# Altium project PCB_Project1.PrjPCB
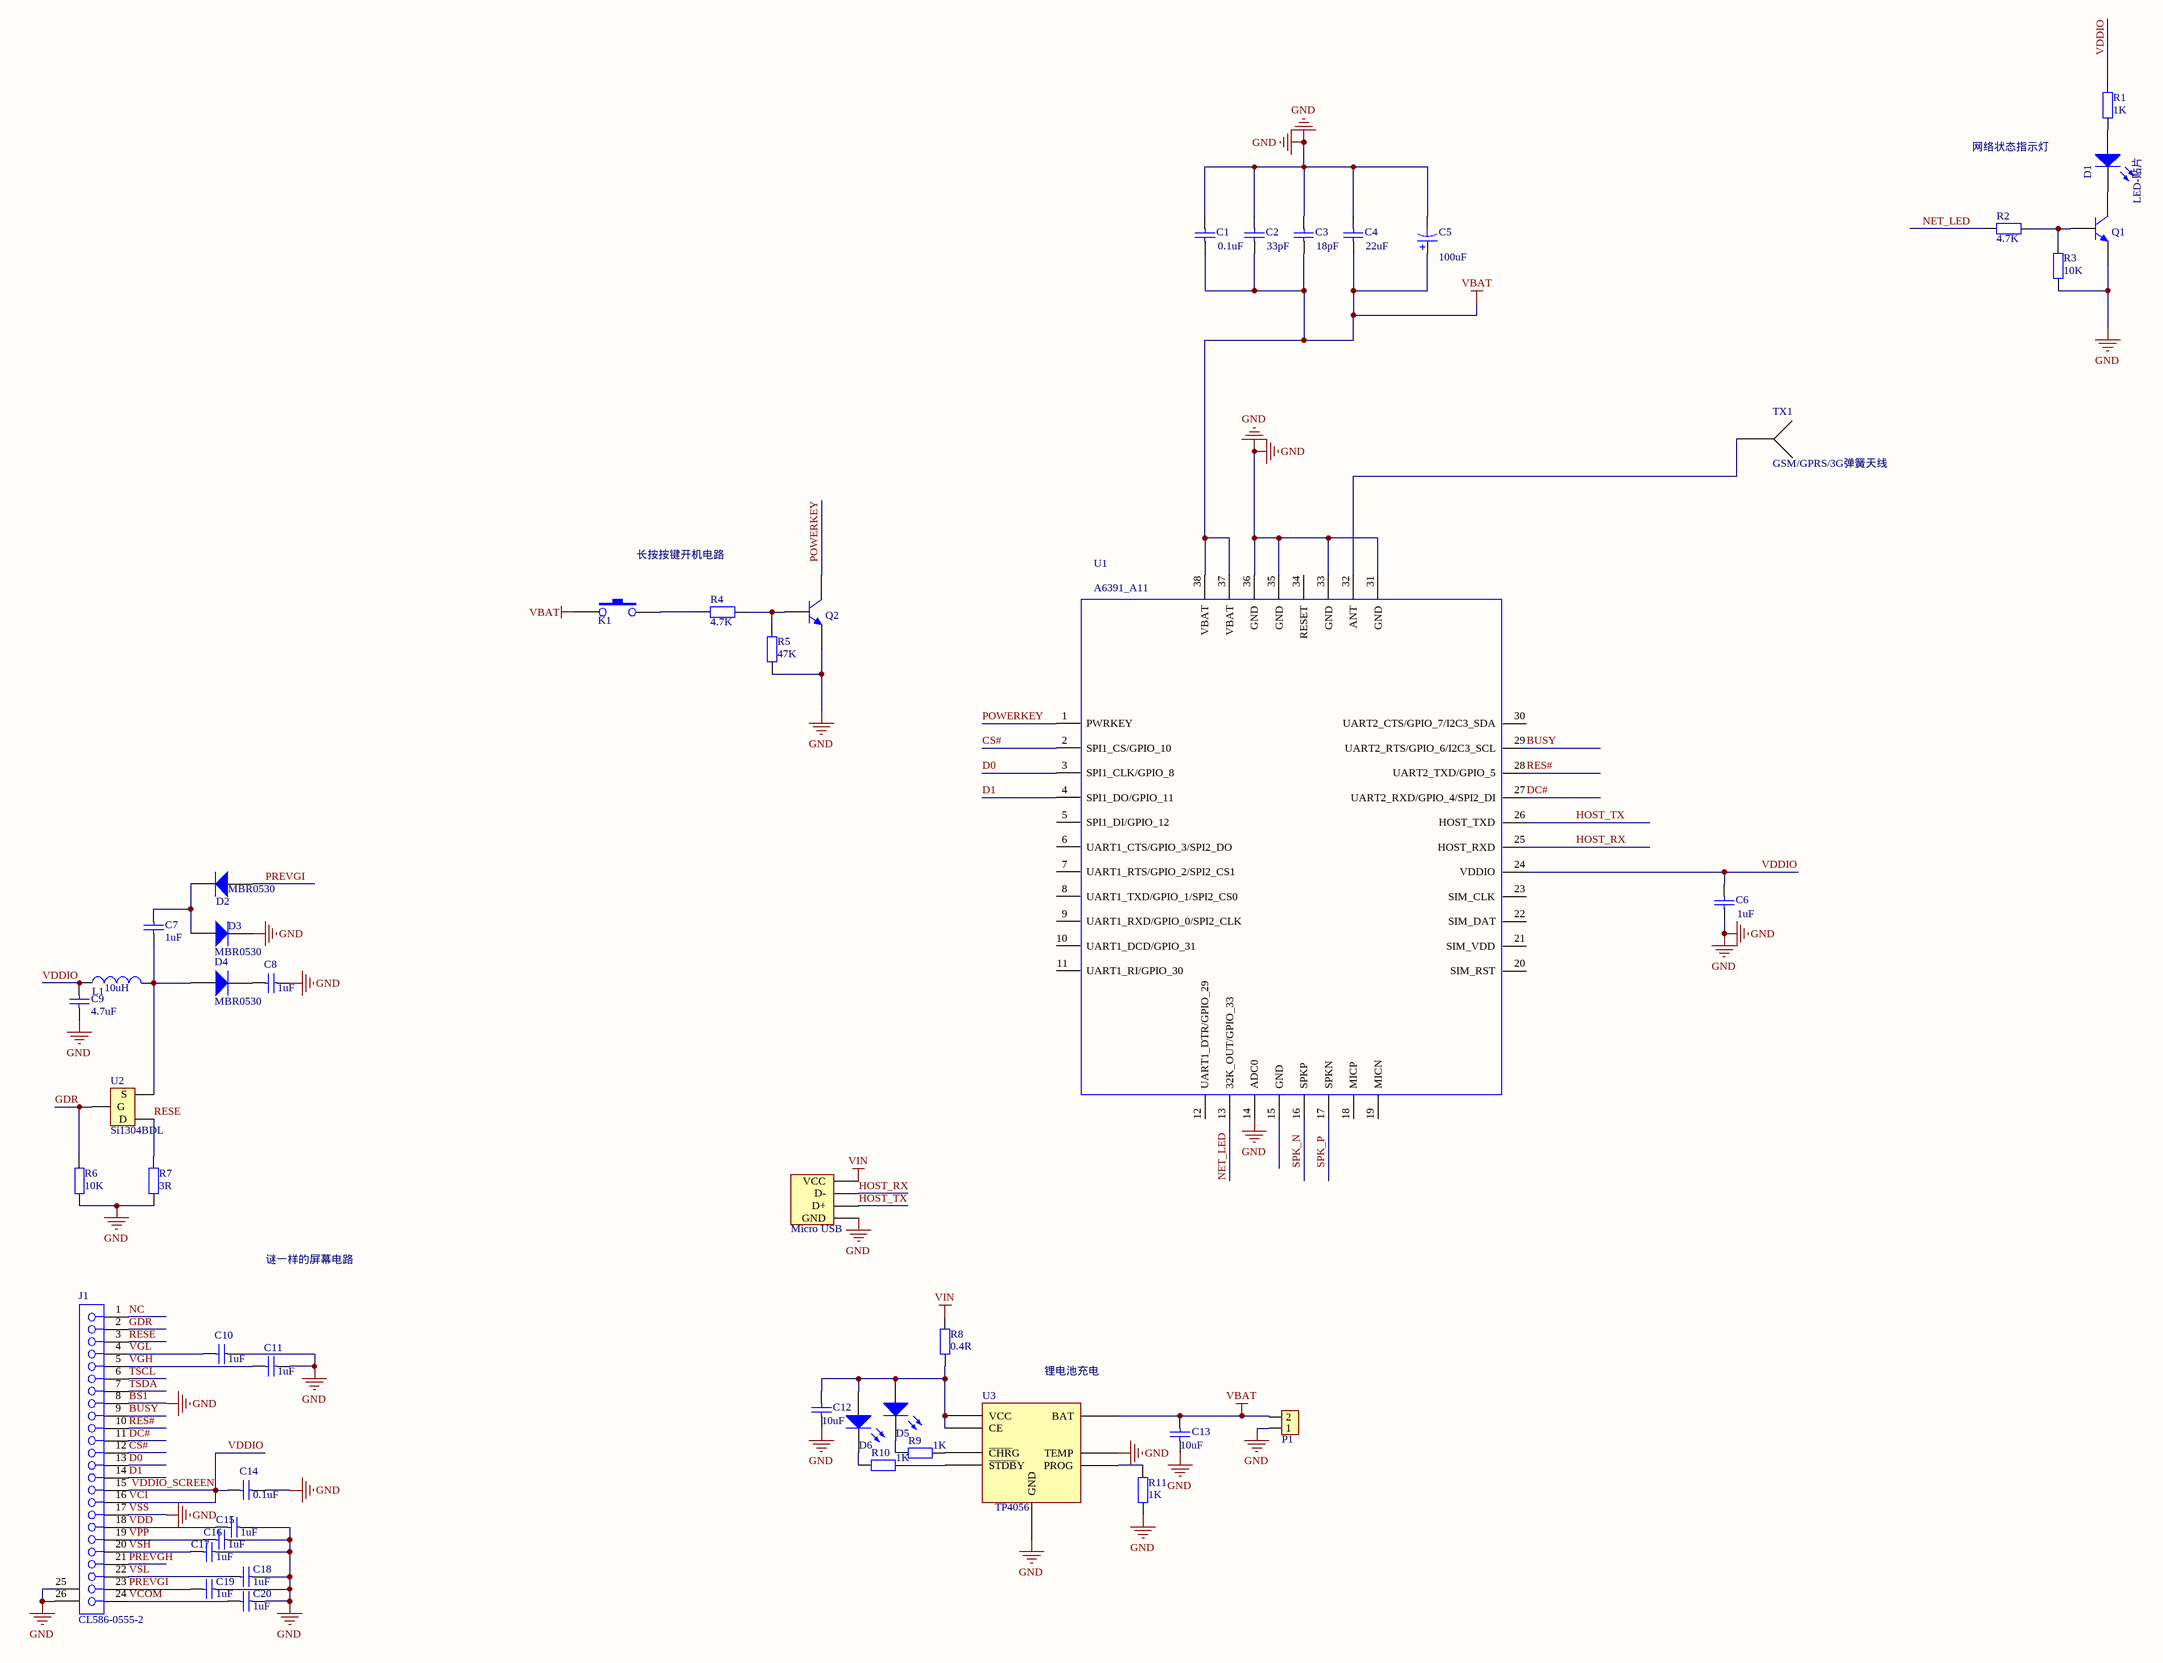
[diagram p0: Sheet2.SchDoc]
1 sheet, 48 parts. Net scope: global (net labels, ports and power ports of the same name join across sheets).
Board file: PCB1.PcbDoc

## Sheet Sheet2.SchDoc
size A1

### Parts
C1  value 0.1uF  [0603AC]  (hidden comment: 无极性电容)
C2  value 33pF  [0603AC]  (hidden comment: 无极性电容)
C3  value 18pF  [0603AC]  (hidden comment: 无极性电容)
C4  value 22uF  [0603AC]  (hidden comment: 无极性电容)
C5  value 100uF  [CAPM-B-3528X21N]  (hidden comment: 贴片铝/钽电容)
C6  value 1uF  [0603AC]  (hidden comment: 无极性电容)
C7  value 1uF  [0603AC]  (hidden comment: 无极性电容)
C8  value 1uF  [0603AC]  (hidden comment: 无极性电容)
C9  value 4.7uF  [0603AC]  (hidden comment: 无极性电容)
C10  value 1uF  [0603AC]  (hidden comment: 无极性电容)
C11  value 1uF  [0603AC]  (hidden comment: 无极性电容)
C12  value 10uF  [0603AC]  (hidden comment: 无极性电容)
C13  value 10uF  [0603AC]  (hidden comment: 无极性电容)
C14  value 0.1uF  [0603AC]  (hidden comment: 无极性电容)
C15  value 1uF  [0603AC]  (hidden comment: 无极性电容)
C16  value 1uF  [0603AC]  (hidden comment: 无极性电容)
C17  value 1uF  [0603AC]  (hidden comment: 无极性电容)
C18  value 1uF  [0603AC]  (hidden comment: 无极性电容)
C19  value 1uF  [0603AC]  (hidden comment: 无极性电容)
C20  value 1uF  [0603AC]  (hidden comment: 无极性电容)
D1  LED-贴片  [LED_0603]
D2  MBR0530  [SOD123]
D3  MBR0530  [SOD123]
D4  MBR0530  [SOD123]
D5  LED-贴片-直插  [LED_0603]  (value not drawn)
D6  LED-贴片-直插  [LED_0603]  (value not drawn)
J1  CL586-0555-2  [FH12-24S-0.5SH]
K1  KEY  [KEY_4*4]  (value not drawn)
L1  value 10uH  [3225]  (hidden comment: LND)
Micro_USB  Micro USB-B  [Micro USB]  (value not drawn)
P1  Header 2  [Header 2]  (value not drawn)
Q1  NPN  [SOT95P230X110-3N]  (value not drawn)
Q2  NPN  [SOT95P230X110-3N]  (value not drawn)
R1  value 1K  [0603AR]  (hidden comment: 贴片电阻)
R2  value 4.7K  [0603AR]  (hidden comment: 贴片电阻)
R3  value 10K  [0603AR]  (hidden comment: 贴片电阻)
R4  value 4.7K  [0603AR]  (hidden comment: 贴片电阻)
R5  value 47K  [0603AR]  (hidden comment: 贴片电阻)
R6  value 10K  [0603AR]  (hidden comment: 贴片电阻)
R7  value 3R  [0603AR]  (hidden comment: 贴片电阻)
R8  value 0.4R  [0603AR]  (hidden comment: 贴片电阻)
R9  value 1K  [0603AR]  (hidden comment: 贴片电阻)
R10  value 1K  [0603AR]  (hidden comment: 贴片电阻)
R11  value 1K  [0603AR]  (hidden comment: 贴片电阻)
TX1  GSM/GPRS/3G弹簧天线  [GSM/GPRS/3G弹簧天线]
U1  A6391_A11  [A6391_A11]
U2  Si1304BDL  [AO3400]
U3  TP4056  [SOP8LM386]

### Nets
BS1: C1.1 C2.1 C3.1 C4.1 C5.2 C6.2 C8.2 C9.1 C10.2 C11.2 C12.1 C13.1 C14.2 C15.2 C16.2 C17.2 C18.2 C19.2 C20.2 D3.2(K) J1.8 J1.17 J1.25(MH1) J1.26(MH2) Micro_USB.4(GND) P1.1 Q1.2(E) Q2.2(E) R3.2 R5.2 R6.2 R7.2 R11.2 U1.14(ADC0) U1.31(GND) U1.33(GND) U1.35(GND) U1.36(GND) U1.39(GND) U1.40(GND) U1.41(GND) U3.1(TEMP) U3.3(GND)  [also labelled GND, VSS]
VBAT: C1.2 C2.2 C3.2 C4.2 C5.1 C13.2 K1.1 P1.2 U1.37(VBAT) U1.38(VBAT) U3.5(BAT)
VIN: Micro_USB.1(VCC) R8.2
BUSY: J1.9 U1.29(UART2_RTS/GPIO_6/I2C3_SCL)
CS#: J1.12 U1.2(SPI1_CS/GPIO_10)
D0: J1.13 U1.3(SPI1_CLK/GPIO_8)
D1: J1.14 U1.4(SPI1_DO/GPIO_11)
DC#: J1.11 U1.27(UART2_RXD/GPIO_4/SPI2_DI)
GDR: J1.2 R6.1 U2.1(G)
HOST_RX: Micro_USB.2(D-) U1.25(HOST_RXD)
HOST_TX: Micro_USB.3(D+) U1.26(HOST_TXD)
NC: J1.1
NET_LED: R2.2 U1.13(32K_OUT/GPIO_33)
POWERKEY: Q2.3(C) U1.1(PWRKEY)
PREVGH: J1.21
PREVGI: C19.1 D2.1(A) J1.23
RES#: J1.10 U1.28(UART2_TXD/GPIO_5)
RESE: J1.3 R7.1 U2.3(D)
SPK_N: U1.16(SPKP)
SPK_P: U1.17(SPKN)
TSCL: J1.6
TSDA: J1.7
VCI: C6.1 C9.2 C14.1 J1.15 J1.16 L1.1 R1.2 U1.24(VDDIO)  [also labelled VDDIO, VDDIO_SCREEN]
VCOM: C20.1 J1.24
VDD: C15.1 J1.18
VGH: C11.1 J1.5
VGL: C10.1 J1.4
VPP: C16.1 J1.19
VSH: C17.1 J1.20
VSL: C18.1 J1.22
NetC7_1: C7.1 D4.1(A) L1.2 U2.2(S)
NetC7_2: C7.2 D2.2(K) D3.1(A)
NetC8_1: C8.1 D4.2(K)
NetC12_2: C12.2 D5.1(A) D6.1(A) R8.1 U3.4(VCC) U3.8(CE)
NetD1_1: D1.1(A) R1.1
NetD1_2: D1.2(K) Q1.3(C)
NetD5_2: D5.2(K) R9.2
NetD6_2: D6.2(K) R10.2
NetK1_2: K1.2 R4.2
NetQ1_1: Q1.1(B) R2.1 R3.1
NetQ2_1: Q2.1(B) R4.1 R5.1
NetR9_1: R9.1 U3.7(~{CHR}G)
NetR10_1: R10.1 U3.6(~{STDB}Y)
NetR11_1: R11.1 U3.2(PROG)
NetTX1_1: TX1.1 U1.32(ANT)

Not connected (* = marked no-connect by the designer): U1 5(SPI1_DI/GPIO_12) 6(UART1_CTS/GPIO_3/SPI2_DO) 7(UART1_RTS/GPIO_2/SPI2_CS1) 8(UART1_TXD/GPIO_1/SPI2_CS0) 9(UART1_RXD/GPIO_0/SPI2_CLK) 10(UART1_DCD/GPIO_31) 11(UART1_RI/GPIO_30) 12(UART1_DTR/GPIO_29) 15(GND) 18(MICP) 19(MICN) 20(SIM_RST) 21(SIM_VDD) 22(SIM_DAT) 23(SIM_CLK) 30(UART2_CTS/GPIO_7/I2C3_SDA) 34(RESET)

### Notes on the sheet
- 网络状态指示灯
- 长按按键开机电路
- 谜一样的屏幕电路
- (near U3) 锂电池充电

### Library data of the parts
C1 = 无极性电容: 0603;0.1uF; Published: 8-Jun-2000; LatestRevisionDate: 17-Jul-2002; LatestRevisionNote: Re-released for DXP Platform.; PackageReference: RAD-0.3; Publisher: Altium Limited; PackageDescription: Radial Cap, Thru-Hole; 2 Leads; 0.3 in Pin Spacing
C2 = 无极性电容: 0603;33pF; Published: 8-Jun-2000; LatestRevisionDate: 17-Jul-2002; LatestRevisionNote: Re-released for DXP Platform.; PackageReference: RAD-0.3; Publisher: Altium Limited; PackageDescription: Radial Cap, Thru-Hole; 2 Leads; 0.3 in Pin Spacing
C3 = 无极性电容: 0603;18pF; Published: 8-Jun-2000; LatestRevisionDate: 17-Jul-2002; LatestRevisionNote: Re-released for DXP Platform.; PackageReference: RAD-0.3; Publisher: Altium Limited; PackageDescription: Radial Cap, Thru-Hole; 2 Leads; 0.3 in Pin Spacing
C4 = 无极性电容: 0603;22pF; Published: 8-Jun-2000; LatestRevisionDate: 17-Jul-2002; LatestRevisionNote: Re-released for DXP Platform.; PackageReference: RAD-0.3; Publisher: Altium Limited; PackageDescription: Radial Cap, Thru-Hole; 2 Leads; 0.3 in Pin Spacing
C5 = 贴片铝/钽电容: Polarized Capacitor (Axial); Published: 8-Jun-2000; LatestRevisionDate: 17-Jul-2002; LatestRevisionNote: Re-released for DXP Platform.; PackageReference: POLAR0.8; Publisher: Altium Limited; PackageDescription: Polarized Capacitor; 2 Leads
C6 = 无极性电容: 0603;1uF; Published: 8-Jun-2000; LatestRevisionDate: 17-Jul-2002; LatestRevisionNote: Re-released for DXP Platform.; PackageReference: RAD-0.3; Publisher: Altium Limited; PackageDescription: Radial Cap, Thru-Hole; 2 Leads; 0.3 in Pin Spacing
C7-C20 = 无极性电容: Capacitor; Published: 8-Jun-2000; LatestRevisionDate: 17-Jul-2002; LatestRevisionNote: Re-released for DXP Platform.; PackageReference: RAD-0.3; Publisher: Altium Limited; PackageDescription: Radial Cap, Thru-Hole; 2 Leads; 0.3 in Pin Spacing
D1 = LED-贴片-直插: 0603;LED
D2-D4 = 二极管
J1 = CL586-0555-2: FH12 Series, "Flip-Lock" SMT/ZIF Connector - 0.5mm Spaced Top Contact; Positions: 24; ContactMaterial: Phosphor Bronze; Current: 0.4A; PCB_Layout: Complies with manufacturer's recommendation.; Note: Pad dimensions follow nominal values, Suitable for Wave Soldering, Adjust for Re-flow.; Published: 17-Jul-2002; DatasheetDocument: 13-Nov-2000; PackageDocument: 13-Nov-2000; PackageReference: FH12A-24S-0.5SH; Publisher: Altium Limited; ComponentLink1Description: Manufacturer Link; ComponentLink1URL: http://www.hiroseusa.com/; ComponentLink2Description: Datasheet; ComponentLink2URL: http://www.hirose.co.jp/cataloge_hp/e58605370.pdf
P1 = Header 2_1: DIP 2.54
Q1 Q2 = NPN_1: NPN;SOT95P230X110-3N
R1 = 贴片电阻: 0603;1K; Published: 8-Jun-2000; LatestRevisionDate: 17-Jul-2002; LatestRevisionNote: Re-released for DXP Platform.; PackageReference: AXIAL-0.4; Publisher: Altium Limited; PackageDescription: Axial Device, Thru-Hole; 2 Leads; 0.4 in Pin Spacing
R2 R4 = 贴片电阻: 0603;4.7K; Published: 8-Jun-2000; LatestRevisionDate: 17-Jul-2002; LatestRevisionNote: Re-released for DXP Platform.; PackageReference: AXIAL-0.4; Publisher: Altium Limited; PackageDescription: Axial Device, Thru-Hole; 2 Leads; 0.4 in Pin Spacing
R3 R5-R7 = 贴片电阻: 0603;10K; Published: 8-Jun-2000; LatestRevisionDate: 17-Jul-2002; LatestRevisionNote: Re-released for DXP Platform.; PackageReference: AXIAL-0.4; Publisher: Altium Limited; PackageDescription: Axial Device, Thru-Hole; 2 Leads; 0.4 in Pin Spacing
R8-R11 = 贴片电阻: Resistor; Published: 8-Jun-2000; LatestRevisionDate: 17-Jul-2002; LatestRevisionNote: Re-released for DXP Platform.; PackageReference: AXIAL-0.4; Publisher: Altium Limited; PackageDescription: Axial Device, Thru-Hole; 2 Leads; 0.4 in Pin Spacing
U1 = A6391_A11: 202芯片; Geometry.Height: 2.3 MM; PCB DECAL: A6391_A11
U2 = AO3400